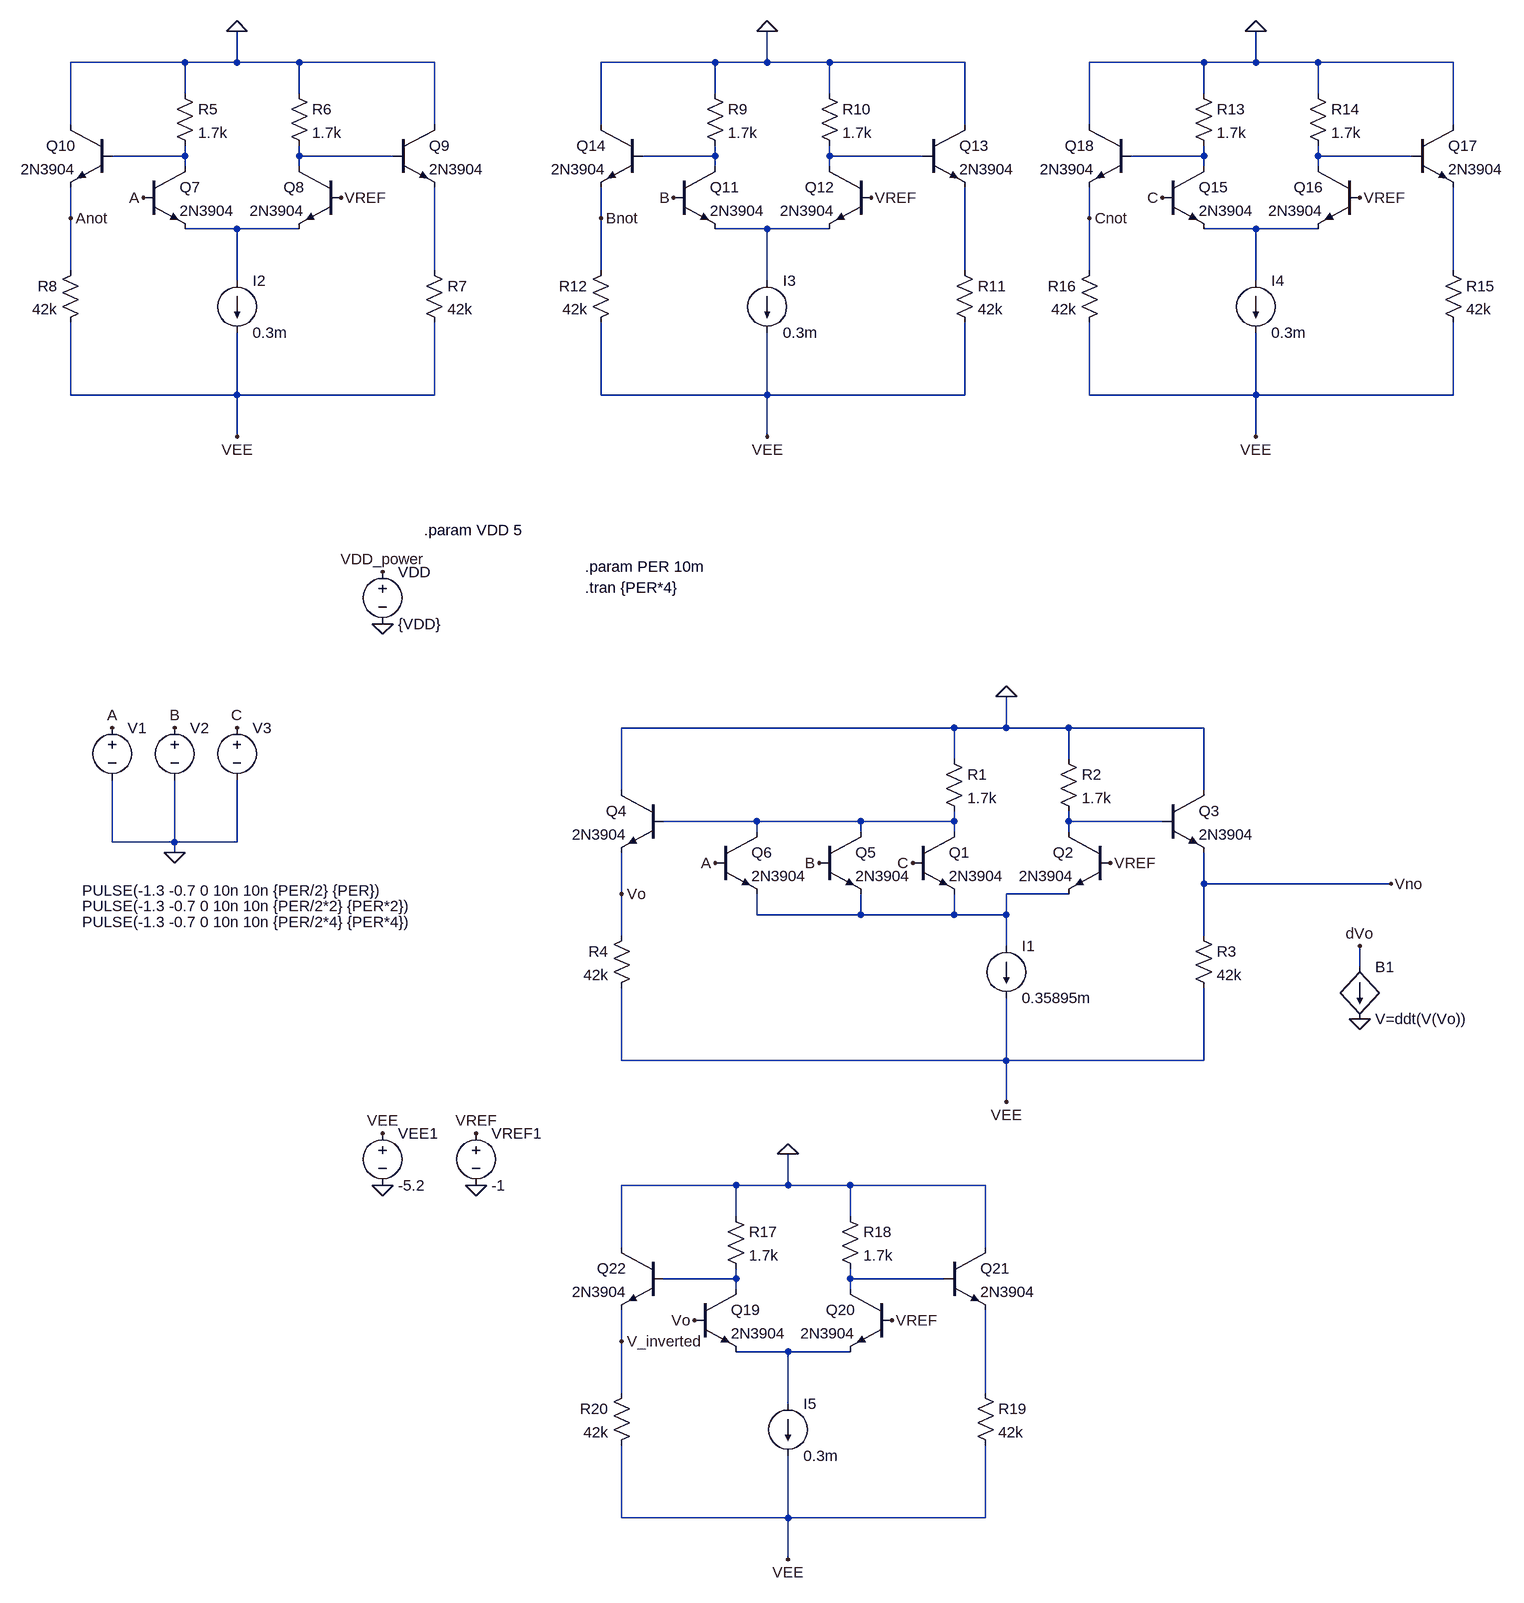
[diagram p0: schematic ECL_3AND.asc]
ECL_3AND.asc, the LTspice schematic file:
Version 4
SHEET 1 1528 1144
WIRE -512 -1248 -688 -1248
WIRE -432 -1248 -432 -1296
WIRE -432 -1248 -512 -1248
WIRE -336 -1248 -432 -1248
WIRE -128 -1248 -336 -1248
WIRE 304 -1248 128 -1248
WIRE 384 -1248 384 -1296
WIRE 384 -1248 304 -1248
WIRE 480 -1248 384 -1248
WIRE 688 -1248 480 -1248
WIRE 1056 -1248 880 -1248
WIRE 1136 -1248 1136 -1296
WIRE 1136 -1248 1056 -1248
WIRE 1232 -1248 1136 -1248
WIRE 1440 -1248 1232 -1248
WIRE -512 -1200 -512 -1248
WIRE -336 -1200 -336 -1248
WIRE 304 -1200 304 -1248
WIRE 480 -1200 480 -1248
WIRE 1056 -1200 1056 -1248
WIRE 1232 -1200 1232 -1248
WIRE -688 -1152 -688 -1248
WIRE -128 -1152 -128 -1248
WIRE 128 -1152 128 -1248
WIRE 688 -1152 688 -1248
WIRE 880 -1152 880 -1248
WIRE 1440 -1152 1440 -1248
WIRE -512 -1104 -512 -1120
WIRE -512 -1104 -624 -1104
WIRE -336 -1104 -336 -1120
WIRE -192 -1104 -336 -1104
WIRE 304 -1104 304 -1120
WIRE 304 -1104 192 -1104
WIRE 480 -1104 480 -1120
WIRE 624 -1104 480 -1104
WIRE 1056 -1104 1056 -1120
WIRE 1056 -1104 944 -1104
WIRE 1232 -1104 1232 -1120
WIRE 1376 -1104 1232 -1104
WIRE -512 -1088 -512 -1104
WIRE -336 -1088 -336 -1104
WIRE 304 -1088 304 -1104
WIRE 480 -1088 480 -1104
WIRE 1056 -1088 1056 -1104
WIRE 1232 -1088 1232 -1104
WIRE -688 -1008 -688 -1056
WIRE 128 -1008 128 -1056
WIRE 880 -1008 880 -1056
WIRE -432 -992 -512 -992
WIRE -336 -992 -432 -992
WIRE 384 -992 304 -992
WIRE 480 -992 384 -992
WIRE 1136 -992 1056 -992
WIRE 1232 -992 1136 -992
WIRE -688 -928 -688 -1008
WIRE -128 -928 -128 -1056
WIRE 128 -928 128 -1008
WIRE 688 -928 688 -1056
WIRE 880 -928 880 -1008
WIRE 1440 -928 1440 -1056
WIRE -432 -912 -432 -992
WIRE 384 -912 384 -992
WIRE 1136 -912 1136 -992
WIRE -688 -736 -688 -848
WIRE -432 -736 -432 -832
WIRE -432 -736 -688 -736
WIRE -128 -736 -128 -848
WIRE -128 -736 -432 -736
WIRE 128 -736 128 -848
WIRE 384 -736 384 -832
WIRE 384 -736 128 -736
WIRE 688 -736 688 -848
WIRE 688 -736 384 -736
WIRE 880 -736 880 -848
WIRE 1136 -736 1136 -832
WIRE 1136 -736 880 -736
WIRE 1440 -736 1440 -848
WIRE 1440 -736 1136 -736
WIRE -432 -672 -432 -736
WIRE 384 -672 384 -736
WIRE 1136 -672 1136 -736
WIRE 672 -224 160 -224
WIRE 752 -224 752 -272
WIRE 752 -224 672 -224
WIRE 848 -224 752 -224
WIRE 1056 -224 848 -224
WIRE 672 -176 672 -224
WIRE 848 -176 848 -224
WIRE 160 -128 160 -224
WIRE 1056 -128 1056 -224
WIRE 368 -80 224 -80
WIRE 528 -80 368 -80
WIRE 672 -80 672 -96
WIRE 672 -80 528 -80
WIRE 848 -80 848 -96
WIRE 992 -80 848 -80
WIRE 368 -64 368 -80
WIRE 528 -64 528 -80
WIRE 672 -64 672 -80
WIRE 848 -64 848 -80
WIRE -624 -48 -624 -144
WIRE -528 -48 -528 -144
WIRE -528 -48 -624 -48
WIRE -432 -48 -432 -144
WIRE -432 -48 -528 -48
WIRE -528 -32 -528 -48
WIRE 1056 16 1056 -32
WIRE 1344 16 1056 16
WIRE 160 32 160 -32
WIRE 848 32 752 32
WIRE 368 64 368 32
WIRE 528 64 528 32
WIRE 528 64 368 64
WIRE 672 64 672 32
WIRE 672 64 528 64
WIRE 752 64 752 32
WIRE 752 64 672 64
WIRE 160 96 160 32
WIRE 1056 96 1056 16
WIRE 752 112 752 64
WIRE 1296 144 1296 112
WIRE 160 288 160 176
WIRE 752 288 752 192
WIRE 752 288 160 288
WIRE 1056 288 1056 176
WIRE 1056 288 752 288
WIRE 752 352 752 288
WIRE 336 480 160 480
WIRE 416 480 416 432
WIRE 416 480 336 480
WIRE 512 480 416 480
WIRE 720 480 512 480
WIRE 336 528 336 480
WIRE 512 528 512 480
WIRE 160 576 160 480
WIRE 720 576 720 480
WIRE 336 624 336 608
WIRE 336 624 224 624
WIRE 512 624 512 608
WIRE 656 624 512 624
WIRE 336 640 336 624
WIRE 512 640 512 624
WIRE 160 720 160 672
WIRE 416 736 336 736
WIRE 512 736 416 736
WIRE 160 800 160 720
WIRE 720 800 720 672
WIRE 416 816 416 736
WIRE 160 992 160 880
WIRE 416 992 416 896
WIRE 416 992 160 992
WIRE 720 992 720 880
WIRE 720 992 416 992
WIRE 416 1056 416 992
FLAG -528 -32 0
FLAG -624 -224 A
FLAG -528 -224 B
FLAG -432 -224 C
FLAG -208 -464 VDD_power
FLAG -208 -384 0
FLAG -64 480 0
FLAG -64 400 VREF
FLAG 1344 16 Vno
FLAG 1296 224 0
FLAG 1296 112 dVo
FLAG -208 400 VEE
FLAG -208 480 0
FLAG 912 -16 VREF
FLAG 752 -272 0
FLAG 752 352 VEE
FLAG 160 32 Vo
FLAG 304 -16 A
FLAG 464 -16 B
FLAG 608 -16 C
FLAG -272 -1040 VREF
FLAG -432 -1296 0
FLAG -432 -672 VEE
FLAG -576 -1040 A
FLAG -688 -1008 Anot
FLAG 544 -1040 VREF
FLAG 384 -1296 0
FLAG 384 -672 VEE
FLAG 240 -1040 B
FLAG 128 -1008 Bnot
FLAG 1296 -1040 VREF
FLAG 1136 -1296 0
FLAG 1136 -672 VEE
FLAG 992 -1040 C
FLAG 880 -1008 Cnot
FLAG 576 688 VREF
FLAG 416 432 0
FLAG 416 1056 VEE
FLAG 272 688 Vo
FLAG 160 720 V_inverted
SYMBOL voltage -624 -240 R0
WINDOW 3 -46 266 Left 2
WINDOW 123 0 0 Left 0
WINDOW 39 0 0 Left 0
SYMATTR Value PULSE(-1.3 -0.7 0 10n 10n {PER/2} {PER})
SYMATTR InstName V1
SYMBOL voltage -528 -240 R0
WINDOW 3 -142 290 Left 2
WINDOW 123 0 0 Left 0
WINDOW 39 0 0 Left 0
SYMATTR Value PULSE(-1.3 -0.7 0 10n 10n {PER/2*2} {PER*2})
SYMATTR InstName V2
SYMBOL voltage -432 -240 R0
WINDOW 3 -238 315 Left 2
WINDOW 123 0 0 Left 0
WINDOW 39 0 0 Left 0
SYMATTR Value PULSE(-1.3 -0.7 0 10n 10n {PER/2*4} {PER*4})
SYMATTR InstName V3
SYMBOL voltage -208 -480 R0
WINDOW 123 0 0 Left 0
WINDOW 39 0 0 Left 0
SYMATTR InstName VDD
SYMATTR Value {VDD}
SYMBOL voltage -64 384 R0
SYMATTR InstName VREF1
SYMATTR Value -1
SYMBOL bi 1296 144 R0
SYMATTR InstName B1
SYMATTR Value V=ddt(V(Vo))
SYMBOL npn 608 -64 R0
SYMATTR InstName Q1
SYMATTR Value 2N3904
SYMBOL npn 912 -64 M0
SYMATTR InstName Q2
SYMATTR Value 2N3904
SYMBOL npn 992 -128 R0
SYMATTR InstName Q3
SYMATTR Value 2N3904
SYMBOL res 656 -192 R0
SYMATTR InstName R1
SYMATTR Value 1.7k
SYMBOL res 832 -192 R0
SYMATTR InstName R2
SYMATTR Value 1.7k
SYMBOL res 1040 80 R0
SYMATTR InstName R3
SYMATTR Value 42k
SYMBOL current 752 112 R0
WINDOW 123 0 0 Left 0
WINDOW 39 0 0 Left 0
SYMATTR InstName I1
SYMATTR Value 0.35895m
SYMBOL voltage -208 384 R0
SYMATTR InstName VEE1
SYMATTR Value -5.2
SYMBOL npn 224 -128 M0
SYMATTR InstName Q4
SYMATTR Value 2N3904
SYMBOL res 176 80 M0
SYMATTR InstName R4
SYMATTR Value 42k
SYMBOL npn 464 -64 R0
SYMATTR InstName Q5
SYMATTR Value 2N3904
SYMBOL npn 304 -64 R0
SYMATTR InstName Q6
SYMATTR Value 2N3904
SYMBOL npn -576 -1088 R0
SYMATTR InstName Q7
SYMATTR Value 2N3904
SYMBOL npn -272 -1088 M0
SYMATTR InstName Q8
SYMATTR Value 2N3904
SYMBOL npn -192 -1152 R0
SYMATTR InstName Q9
SYMATTR Value 2N3904
SYMBOL res -528 -1216 R0
SYMATTR InstName R5
SYMATTR Value 1.7k
SYMBOL res -352 -1216 R0
SYMATTR InstName R6
SYMATTR Value 1.7k
SYMBOL res -144 -944 R0
SYMATTR InstName R7
SYMATTR Value 42k
SYMBOL current -432 -912 R0
WINDOW 123 0 0 Left 0
WINDOW 39 0 0 Left 0
SYMATTR InstName I2
SYMATTR Value 0.3m
SYMBOL npn -624 -1152 M0
SYMATTR InstName Q10
SYMATTR Value 2N3904
SYMBOL res -672 -944 M0
SYMATTR InstName R8
SYMATTR Value 42k
SYMBOL npn 240 -1088 R0
SYMATTR InstName Q11
SYMATTR Value 2N3904
SYMBOL npn 544 -1088 M0
SYMATTR InstName Q12
SYMATTR Value 2N3904
SYMBOL npn 624 -1152 R0
SYMATTR InstName Q13
SYMATTR Value 2N3904
SYMBOL res 288 -1216 R0
SYMATTR InstName R9
SYMATTR Value 1.7k
SYMBOL res 464 -1216 R0
SYMATTR InstName R10
SYMATTR Value 1.7k
SYMBOL res 672 -944 R0
SYMATTR InstName R11
SYMATTR Value 42k
SYMBOL current 384 -912 R0
WINDOW 123 0 0 Left 0
WINDOW 39 0 0 Left 0
SYMATTR InstName I3
SYMATTR Value 0.3m
SYMBOL npn 192 -1152 M0
SYMATTR InstName Q14
SYMATTR Value 2N3904
SYMBOL res 144 -944 M0
SYMATTR InstName R12
SYMATTR Value 42k
SYMBOL npn 992 -1088 R0
SYMATTR InstName Q15
SYMATTR Value 2N3904
SYMBOL npn 1296 -1088 M0
SYMATTR InstName Q16
SYMATTR Value 2N3904
SYMBOL npn 1376 -1152 R0
SYMATTR InstName Q17
SYMATTR Value 2N3904
SYMBOL res 1040 -1216 R0
SYMATTR InstName R13
SYMATTR Value 1.7k
SYMBOL res 1216 -1216 R0
SYMATTR InstName R14
SYMATTR Value 1.7k
SYMBOL res 1424 -944 R0
SYMATTR InstName R15
SYMATTR Value 42k
SYMBOL current 1136 -912 R0
WINDOW 123 0 0 Left 0
WINDOW 39 0 0 Left 0
SYMATTR InstName I4
SYMATTR Value 0.3m
SYMBOL npn 944 -1152 M0
SYMATTR InstName Q18
SYMATTR Value 2N3904
SYMBOL res 896 -944 M0
SYMATTR InstName R16
SYMATTR Value 42k
SYMBOL npn 272 640 R0
SYMATTR InstName Q19
SYMATTR Value 2N3904
SYMBOL npn 576 640 M0
SYMATTR InstName Q20
SYMATTR Value 2N3904
SYMBOL npn 656 576 R0
SYMATTR InstName Q21
SYMATTR Value 2N3904
SYMBOL res 320 512 R0
SYMATTR InstName R17
SYMATTR Value 1.7k
SYMBOL res 496 512 R0
SYMATTR InstName R18
SYMATTR Value 1.7k
SYMBOL res 704 784 R0
SYMATTR InstName R19
SYMATTR Value 42k
SYMBOL current 416 816 R0
WINDOW 123 0 0 Left 0
WINDOW 39 0 0 Left 0
SYMATTR InstName I5
SYMATTR Value 0.3m
SYMBOL npn 224 576 M0
SYMATTR InstName Q22
SYMATTR Value 2N3904
SYMBOL res 176 784 M0
SYMATTR InstName R20
SYMATTR Value 42k
TEXT 104 -472 Left 2 !.param PER 10m
TEXT 104 -440 Left 2 !.tran {PER*4}
TEXT -144 -528 Left 2 !.param VDD 5

The netlist it stands for:
* ECL_3AND.asc
V1 A 0 PULSE(-1.3 -0.7 0 10n 10n {PER/2} {PER})
V2 B 0 PULSE(-1.3 -0.7 0 10n 10n {PER/2*2} {PER*2})
V3 C 0 PULSE(-1.3 -0.7 0 10n 10n {PER/2*4} {PER*4})
VDD VDD_power 0 {VDD}
VREF1 VREF 0 -1
B1 dVo 0 V=ddt(V(Vo))
Q1 N013 C N015 0 2N3904
Q2 N014 VREF N015 0 2N3904
Q3 0 N014 Vno 0 2N3904
R1 0 N013 1.7k
R2 0 N014 1.7k
R3 Vno VEE 42k
I1 N015 VEE 0.35895m
VEE1 VEE 0 -5.2
Q4 0 N013 Vo 0 2N3904
R4 Vo VEE 42k
Q5 N013 B N015 0 2N3904
Q6 N013 A N015 0 2N3904
Q7 N001 A N007 0 2N3904
Q8 N002 VREF N007 0 2N3904
Q9 0 N002 N010 0 2N3904
R5 0 N001 1.7k
R6 0 N002 1.7k
R7 N010 VEE 42k
I2 N007 VEE 0.3m
Q10 0 N001 Anot 0 2N3904
R8 Anot VEE 42k
Q11 N003 B N008 0 2N3904
Q12 N004 VREF N008 0 2N3904
Q13 0 N004 N011 0 2N3904
R9 0 N003 1.7k
R10 0 N004 1.7k
R11 N011 VEE 42k
I3 N008 VEE 0.3m
Q14 0 N003 Bnot 0 2N3904
R12 Bnot VEE 42k
Q15 N005 C N009 0 2N3904
Q16 N006 VREF N009 0 2N3904
Q17 0 N006 N012 0 2N3904
R13 0 N005 1.7k
R14 0 N006 1.7k
R15 N012 VEE 42k
I4 N009 VEE 0.3m
Q18 0 N005 Cnot 0 2N3904
R16 Cnot VEE 42k
Q19 N016 Vo N018 0 2N3904
Q20 N017 VREF N018 0 2N3904
Q21 0 N017 N019 0 2N3904
R17 0 N016 1.7k
R18 0 N017 1.7k
R19 N019 VEE 42k
I5 N018 VEE 0.3m
Q22 0 N016 V_inverted 0 2N3904
R20 V_inverted VEE 42k
.model NPN NPN
.model PNP PNP
.lib standard.bjt
.param PER 10m
.tran {PER*4}
.param VDD 5
.backanno
.end